# EAGLE design zSum_4_mainboard_rev_A (EAGLE 6.5.0)

## Sheet 1 of 2
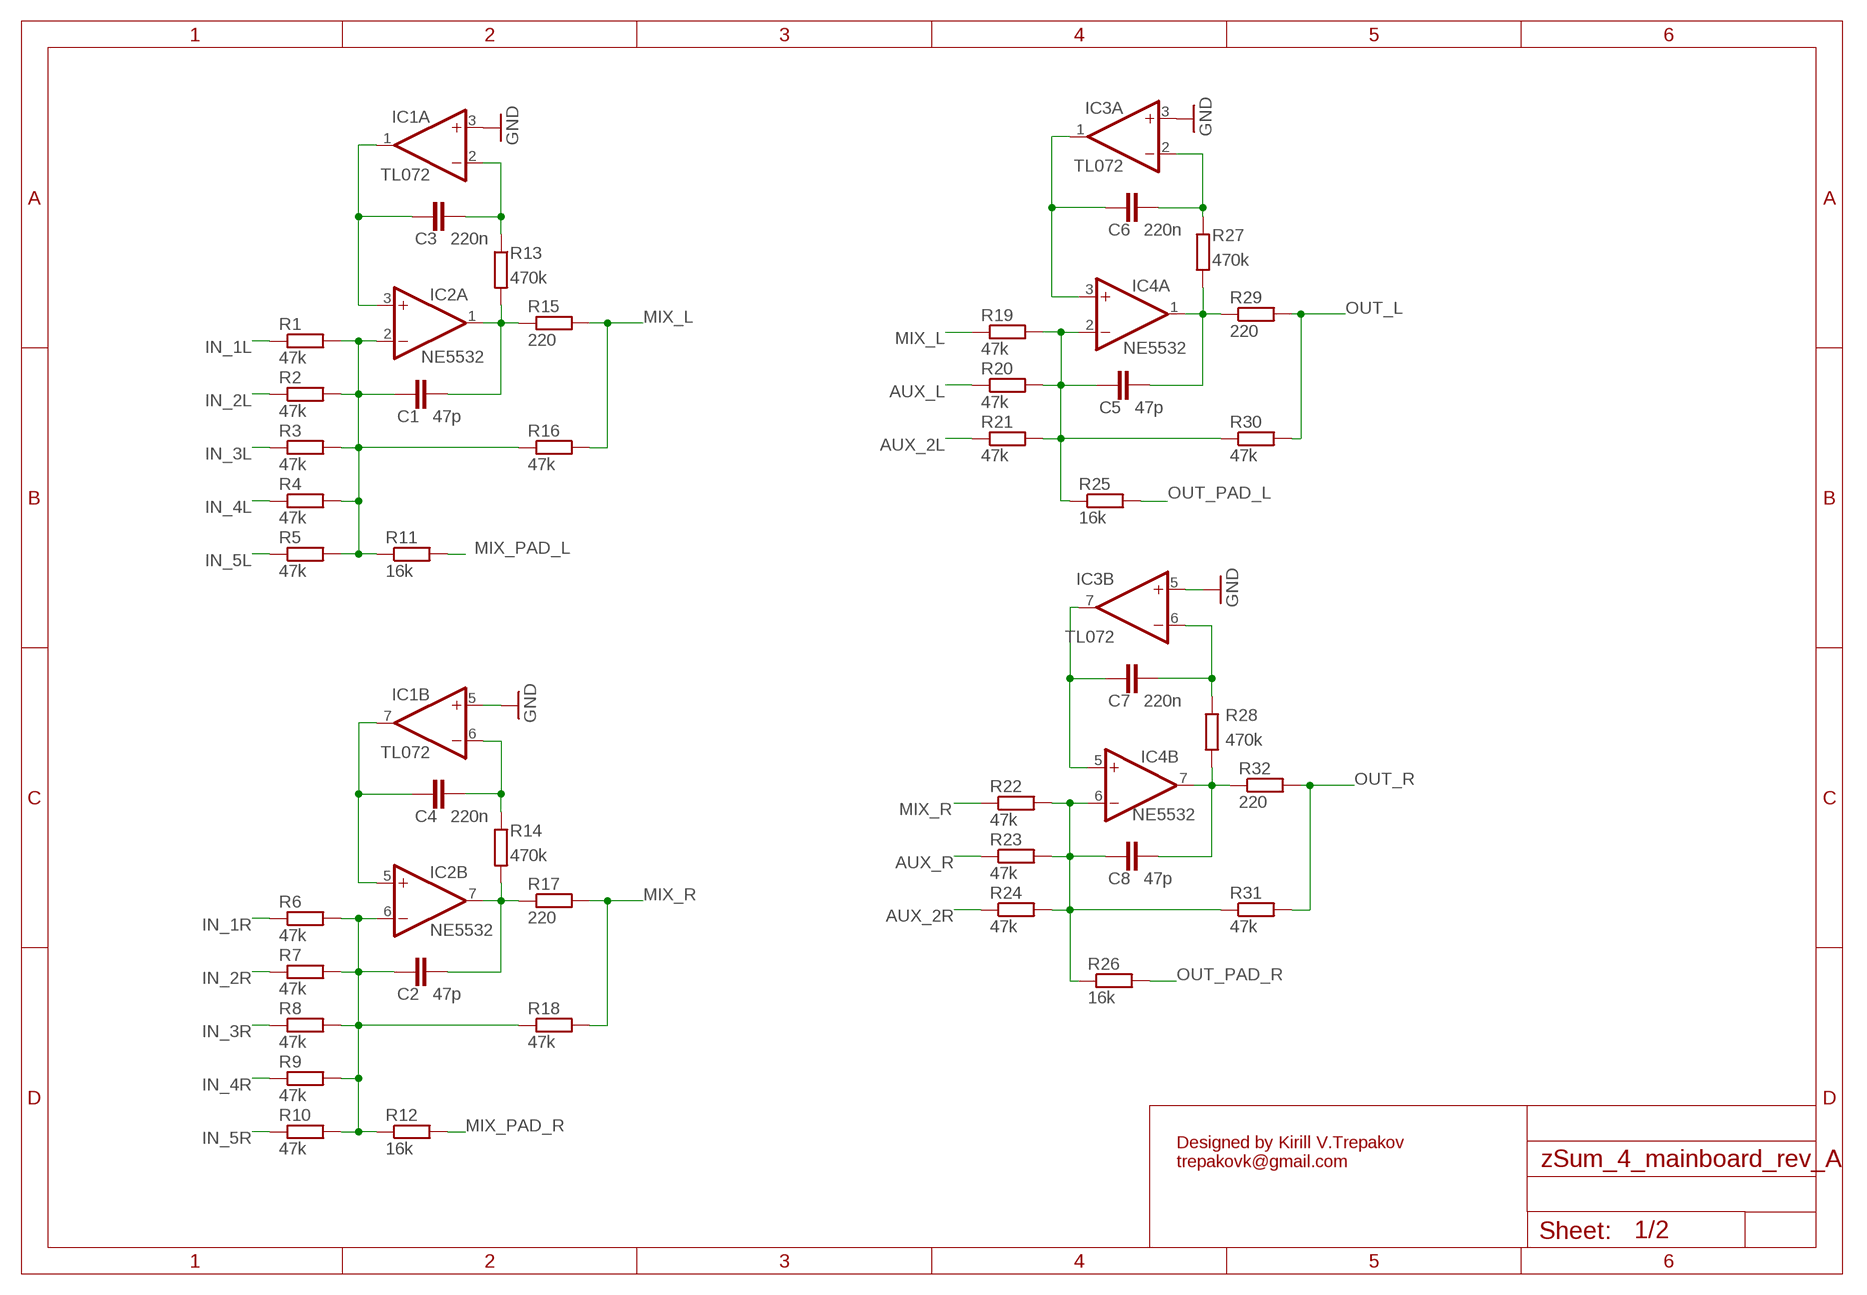
[diagram p0: schematic, sheet 1]

### Parts
C1  47p  C-EU025-025X050  [C025-025X050]
C2  47p  C-EU025-025X050  [C025-025X050]
C3  220n  C-EU050-025X075  [C050-025X075]
C4  220n  C-EU050-025X075  [C050-025X075]
C5  47p  C-EU025-025X050  [C025-025X050]
C6  220n  C-EU050-025X075  [C050-025X075]
C7  220n  C-EU050-025X075  [C050-025X075]
C8  47p  C-EU025-025X050  [C025-025X050]
IC1  TL072  TL072P  [DIL08]
IC2  NE5532  TL072P  [DIL08]
IC3  TL072  TL072P  [DIL08]
IC4  NE5532  TL072P  [DIL08]
R1  47k  R-EU_0207/7  [0207/7]
R2  47k  R-EU_0207/7  [0207/7]
R3  47k  R-EU_0207/7  [0207/7]
R4  47k  R-EU_0207/7  [0207/7]
R5  47k  R-EU_0207/7  [0207/7]
R6  47k  R-EU_0207/7  [0207/7]
R7  47k  R-EU_0207/7  [0207/7]
R8  47k  R-EU_0207/7  [0207/7]
R9  47k  R-EU_0207/7  [0207/7]
R10  47k  R-EU_0207/7  [0207/7]
R11  16k  R-EU_0207/7  [0207/7]
R12  16k  R-EU_0207/7  [0207/7]
R13  470k  R-EU_0207/7  [0207/7]
R14  470k  R-EU_0207/7  [0207/7]
R15  220  R-EU_0207/7  [0207/7]
R16  47k  R-EU_0207/7  [0207/7]
R17  220  R-EU_0207/7  [0207/7]
R18  47k  R-EU_0207/7  [0207/7]
R19  47k  R-EU_0207/7  [0207/7]
R20  47k  R-EU_0207/7  [0207/7]
R21  47k  R-EU_0207/7  [0207/7]
R22  47k  R-EU_0207/7  [0207/7]
R23  47k  R-EU_0207/7  [0207/7]
R24  47k  R-EU_0207/7  [0207/7]
R25  16k  R-EU_0207/7  [0207/7]
R26  16k  R-EU_0207/7  [0207/7]
R27  470k  R-EU_0207/7  [0207/7]
R28  470k  R-EU_0207/7  [0207/7]
R29  220  R-EU_0207/7  [0207/7]
R30  47k  R-EU_0207/7  [0207/7]
R31  47k  R-EU_0207/7  [0207/7]
R32  220  R-EU_0207/7  [0207/7]

### Nets
AUX_2L: R21.1 ; also sheet 2
AUX_2R: R24.1 ; also sheet 2
AUX_L: R20.1 ; also sheet 2
AUX_R: R23.1 ; also sheet 2
BIAS_L: C3.2 IC1.1(A:OUT) IC2.3(A:+IN)
BIAS_L1: C6.2 IC3.1(A:OUT) IC4.3(A:+IN)
BIAS_R: C4.2 IC1.7(B:OUT) IC2.5(B:+IN)
BIAS_R1: C7.2 IC3.7(B:OUT) IC4.5(B:+IN)
GND: IC1.3(A:+IN) IC1.5(B:+IN) IC3.3(A:+IN) IC3.5(B:+IN) ; also sheet 2
IN_1L: R1.1 ; also sheet 2
IN_1R: R6.1 ; also sheet 2
IN_2L: R2.1 ; also sheet 2
IN_2R: R7.1 ; also sheet 2
IN_3L: R3.1 ; also sheet 2
IN_3R: R8.1 ; also sheet 2
IN_4L: R4.1 ; also sheet 2
IN_4R: R9.1 ; also sheet 2
IN_5L: R5.1 ; also sheet 2
IN_5R: R10.1 ; also sheet 2
MIX_L: R15.2 R16.2 R19.1 ; also sheet 2
MIX_PAD_L: R11.2 ; also sheet 2
MIX_PAD_R: R12.2 ; also sheet 2
MIX_R: R17.2 R18.2 R22.1 ; also sheet 2
N$1: C6.1 IC3.2(A:-IN) R27.1
N$2: C7.1 IC3.6(B:-IN) R28.1
N$9: C3.1 IC1.2(A:-IN) R13.1
N$10: C1.1 IC2.1(A:OUT) R13.2 R15.1
N$11: C4.1 IC1.6(B:-IN) R14.1
N$12: C2.1 IC2.7(B:OUT) R14.2 R17.1
N$14: C5.1 IC4.1(A:OUT) R27.2 R29.1
N$20: C8.1 IC4.7(B:OUT) R28.2 R32.1
OUT_L: R29.2 R30.2 ; also sheet 2
OUT_PAD_L: R25.2 ; also sheet 2
OUT_PAD_R: R26.2 ; also sheet 2
OUT_R: R31.2 R32.2 ; also sheet 2
VGND_MIX_L: C1.2 IC2.2(A:-IN) R1.2 R2.2 R3.2 R4.2 R5.2 R11.1 R16.1
VGND_MIX_R: C2.2 IC2.6(B:-IN) R6.2 R7.2 R8.2 R9.2 R10.2 R12.1 R18.1
VGND_OUT_L: C5.2 IC4.2(A:-IN) R19.2 R20.2 R21.2 R25.1 R30.1
VGND_OUT_R: C8.2 IC4.6(B:-IN) R22.2 R23.2 R24.2 R26.1 R31.1

### Notes on the sheet
- Designed by Kirill V.Trepakov
  trepakovk@gmail.com

## Sheet 2 of 2
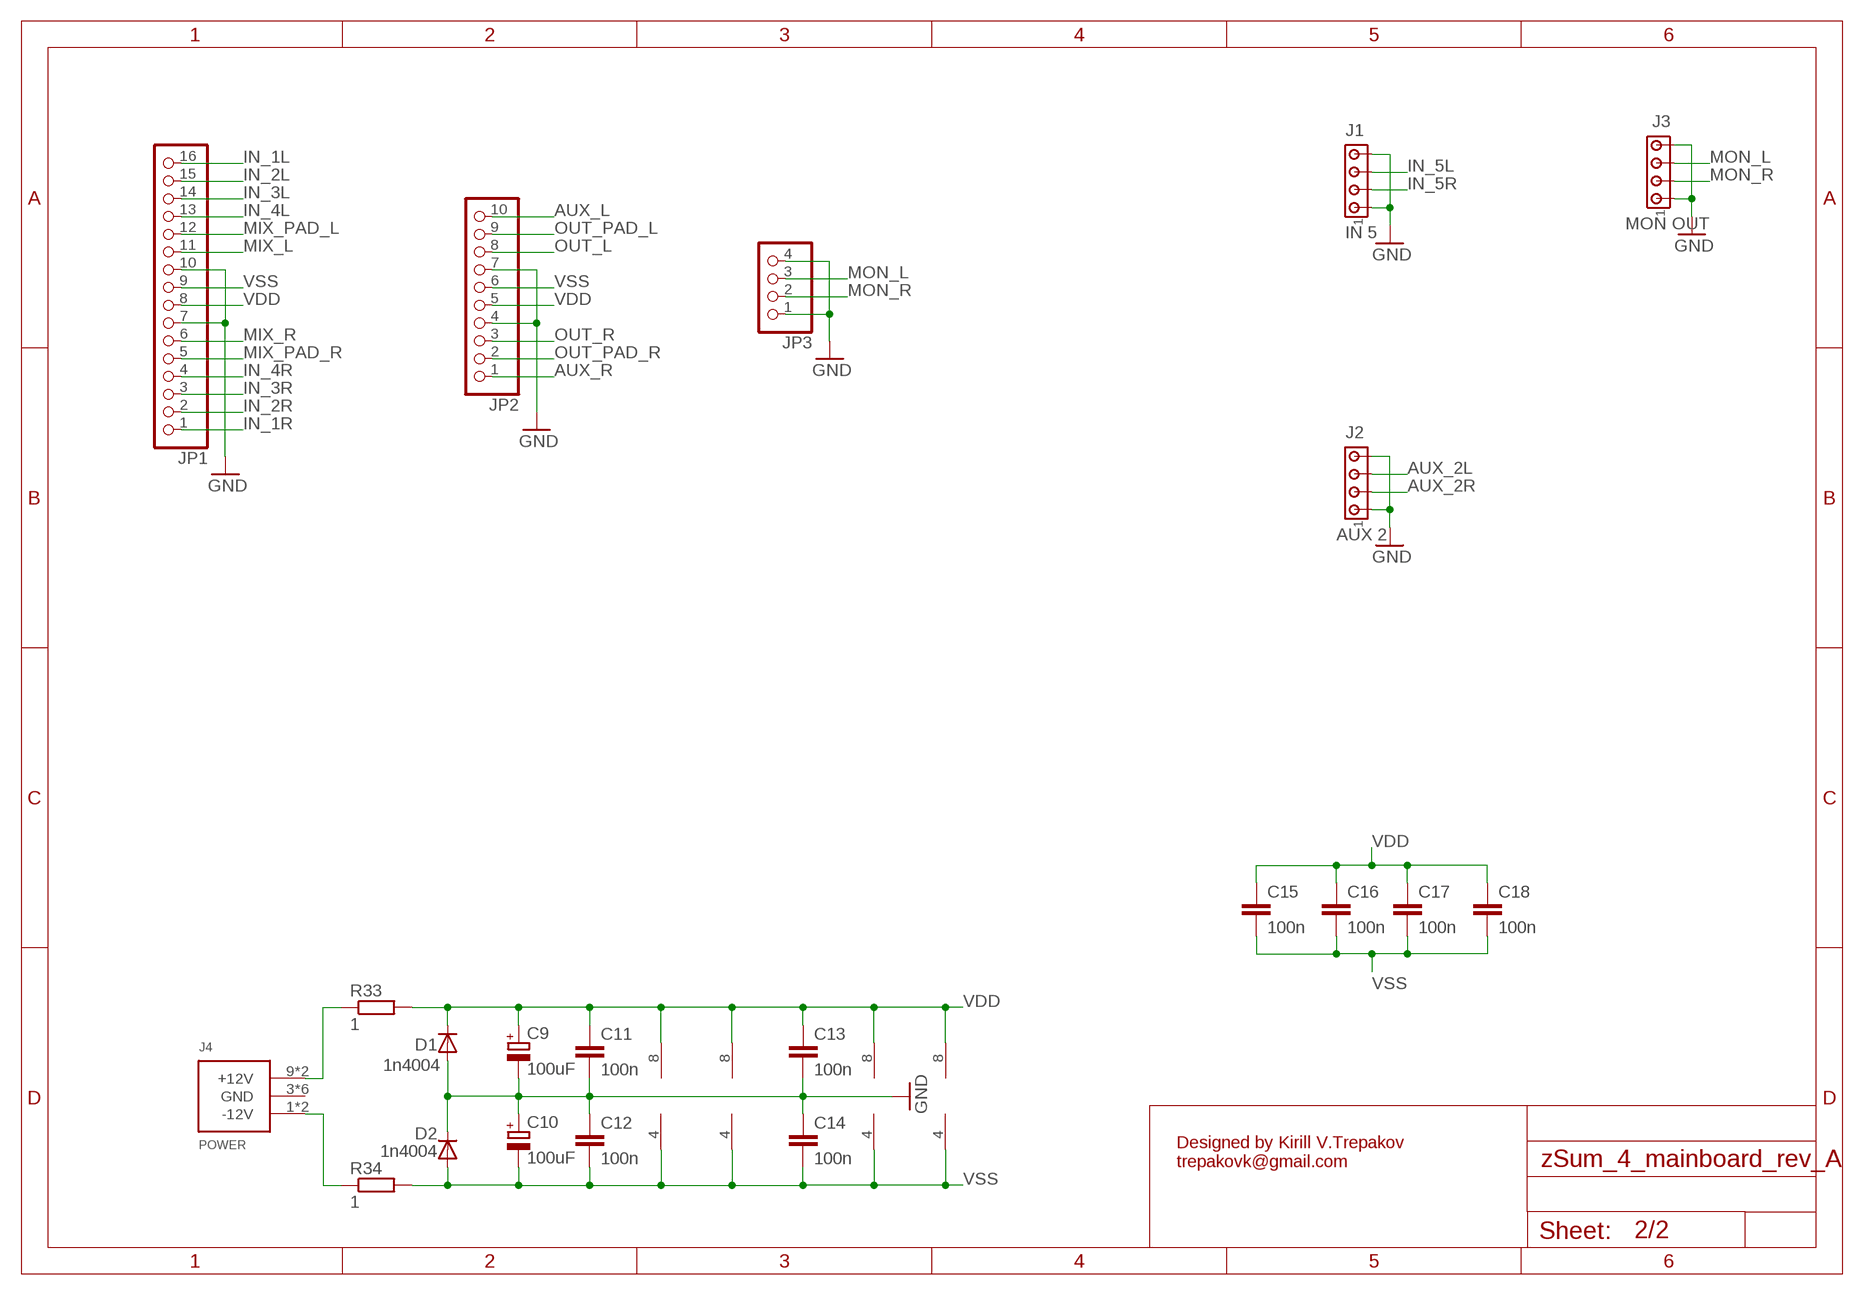
[diagram p1: schematic, sheet 2]

### Parts
C9  100uF  CPOL-EUE2.5-6  [E2,5-6]
C10  100uF  CPOL-EUE2.5-6  [E2,5-6]
C11  100n  C-EU050-025X075  [C050-025X075]
C12  100n  C-EU050-025X075  [C050-025X075]
C13  100n  C-EU050-025X075  [C050-025X075]
C14  100n  C-EU050-025X075  [C050-025X075]
C15  100n  C-EUC1206  [C1206]
C16  100n  C-EUC1206  [C1206]
C17  100n  C-EUC1206  [C1206]
C18  100n  C-EUC1206  [C1206]
D1  1n4004  1N4004"  [DO41-7.6]
D2  1n4004  1N4004"  [DO41-7.6]
J1  IN 5  MTA04-100  [10X04MTA]
J2  AUX 2  MTA04-100  [10X04MTA]
J3  MON OUT  MTA04-100  [10X04MTA]
J4  POWER  POWER_SIMPLEM  [POWER_10M]
JP1  PINHD-1X16  [1X16_]
JP2  PINHD-1X10  [1X10_]
JP3  PINHD-1X4  [1X04]
R33  1  R-EU_0207/7  [0207/7]
R34  1  R-EU_0207/7  [0207/7]

### Nets
AUX_2L: J2.3 ; also sheet 1
AUX_2R: J2.2 ; also sheet 1
AUX_L: JP2.10 ; also sheet 1
AUX_R: JP2.1 ; also sheet 1
GND: C9.- C10.+ C11.2 C12.1 C13.2 C14.1 D1.A D2.C J1.1 J1.4 J2.1 J2.4 J3.1 J3.4 JP1.7 JP1.10 JP2.4 JP2.7 JP3.1 JP3.4 ; also sheet 1
IN_1L: JP1.16 ; also sheet 1
IN_1R: JP1.1 ; also sheet 1
IN_2L: JP1.15 ; also sheet 1
IN_2R: JP1.2 ; also sheet 1
IN_3L: JP1.14 ; also sheet 1
IN_3R: JP1.3 ; also sheet 1
IN_4L: JP1.13 ; also sheet 1
IN_4R: JP1.4 ; also sheet 1
IN_5L: J1.3 ; also sheet 1
IN_5R: J1.2 ; also sheet 1
MIX_L: JP1.11 ; also sheet 1
MIX_PAD_L: JP1.12 ; also sheet 1
MIX_PAD_R: JP1.5 ; also sheet 1
MIX_R: JP1.6 ; also sheet 1
MON_L: J3.3 JP3.3
MON_R: J3.2 JP3.2
N$3: J4.1(-12V) J4.2(-12V) R34.1
N$4: J4.9(+12V) J4.10(+12V) R33.1
OUT_L: JP2.8 ; also sheet 1
OUT_PAD_L: JP2.9 ; also sheet 1
OUT_PAD_R: JP2.2 ; also sheet 1
OUT_R: JP2.3 ; also sheet 1
VDD: C9.+ C11.1 C13.1 C15.1 C16.1 C17.1 C18.1 D1.C IC1.8(P:V+) IC2.8(P:V+) IC3.8(P:V+) IC4.8(P:V+) JP1.8 JP2.5 R33.2
VSS: C10.- C12.2 C14.2 C15.2 C16.2 C17.2 C18.2 D2.A IC1.4(P:V-) IC2.4(P:V-) IC3.4(P:V-) IC4.4(P:V-) JP1.9 JP2.6 R34.2
Unconnected: J4.3(GND) J4.4(GND) J4.5(GND) J4.6(GND) J4.7(GND) J4.8(GND)

### Notes on the sheet
- Designed by Kirill V.Trepakov
  trepakovk@gmail.com

## Library data of the parts
C1-C8 C11-C18 = rcl:C-EU: CAPACITOR, European symbol
C9 C10 = rcl:CPOL-EU: POLARIZED CAPACITOR, European symbol
D1 D2 = _motovilo:1N4004: DIODE general purpose rectifier, 1 A
IC1-IC4 = kvitekp:TL072: OP AMP
J1-J3 = con-amp:MTA04-100: AMP connector
J4 = _motovilo:POWER_SIMPLE
JP1 = _mtvl.connectors:PINHD-1X16: PIN HEADER
JP2 = _mtvl.connectors:PINHD-1X10: PIN HEADER
JP3 = _mtvl.connectors:PINHD-1X4: PIN HEADER
R1-R34 = rcl:R-EU_: RESISTOR, European symbol

## Board
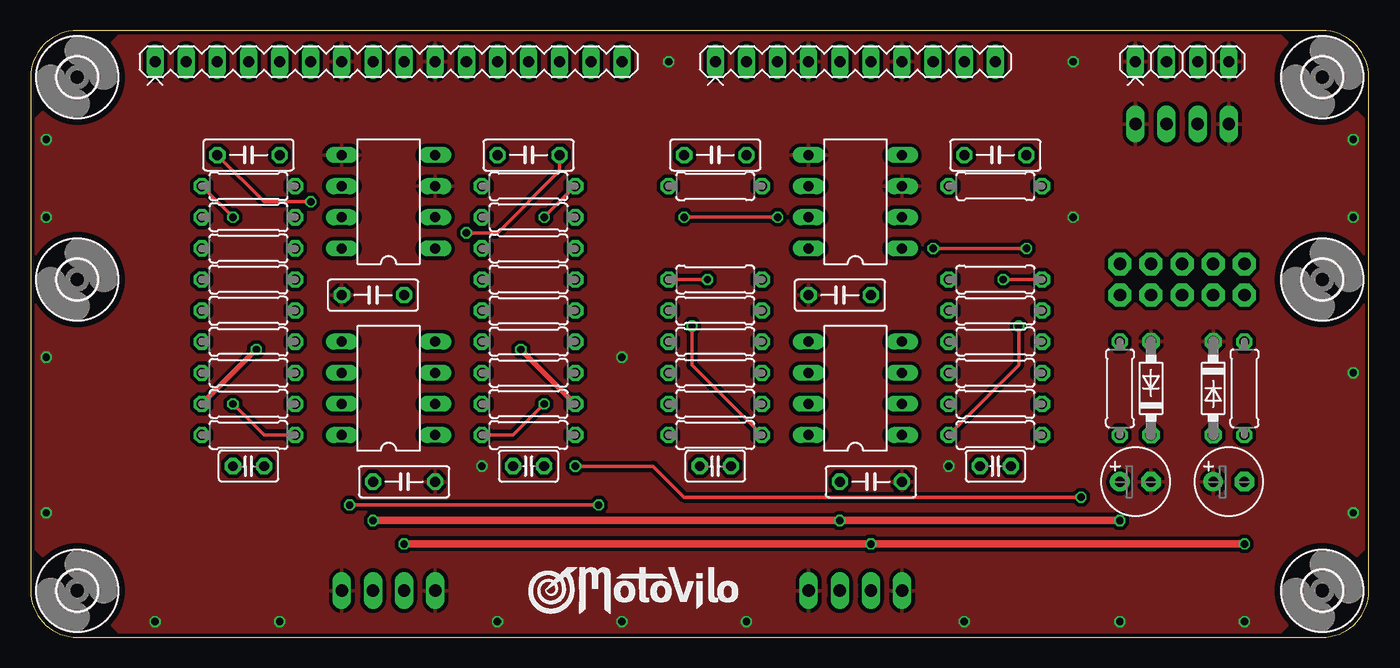
[diagram p2: board, top side]
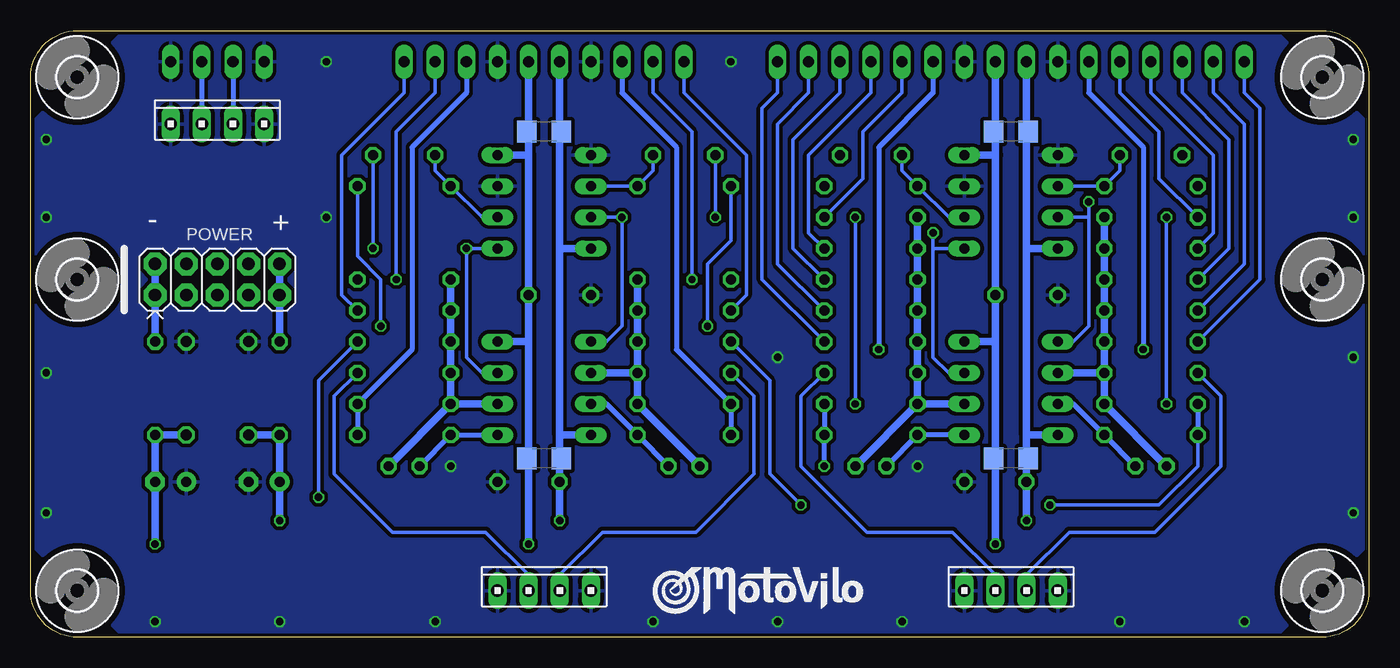
[diagram p3: board, bottom side, seen from below]

Size 109.22 x 49.53 mm. Coordinates in mm from the lower left corner, seen from the top.
Outline: 3.81,0 105.41,0 arc90 109.22,3.81 109.22,45.72 arc90 105.41,49.53 3.81,49.53 arc90 0,45.72 0,3.81 arc90 3.81,0
Copper layers (1*16): Top 0.035mm / dielectric 1.5mm / Bottom 0.035mm
Design rules "ITEADstudio_DRC_z *": minimum track width 6mil, minimum drill 12mil, track to track 10mil, track to pad 10mil, pad to pad 10mil, via to via 10mil, smd to smd 0mil, copper to edge 10mil, drill to drill 10mil, minimum pad ring 10mil, minimum via ring 6mil, stop-mask expansion 2mil, vias tented up to drill 100mil, thermal gap 12mil

### Footprints (pad centres in the part's own frame; a part is rotated, then mirrored left to right if it is on the bottom)
C025-025X050 = drill 0.813 octagon: 1 -1.27,0; 2 1.27,0
C050-025X075 = drill 0.813 octagon: 1 -2.54,0; 2 2.54,0
E2,5-6 = drill 0.813 pad 1.6: + -1.27,0 | drill 0.813 pad 1.6 octagon: - 1.27,0
C1206 = smd 1.6 x 1.8: 1 -1.4,0; 2 1.4,0
DO41-7.6 = drill 0.9 octagon: A 3.81,0; C -3.81,0
DIL08 = drill 0.813 long: 1 -3.81,-3.81; 2 -1.27,-3.81; 3 1.27,-3.81; 4 3.81,-3.81; 5 3.81,3.81; 6 1.27,3.81; 7 -1.27,3.81; 8 -3.81,3.81
10X04MTA = drill 1.016 long: 1 3.81,0; 2 1.27,0; 3 -1.27,0; 4 -3.81,0
POWER_10M = drill 1.016 pad 1.88 octagon: 1 1.27,-5.08; 2 -1.27,-5.08; 3 1.27,-2.54; 4 -1.27,-2.54; 5 1.27,0; 6 -1.27,0; 7 1.27,2.54; 8 -1.27,2.54; 9 1.27,5.08; 10 -1.27,5.08
1X16_ = drill 0.9 long: 1 -19.05,0; 2 -16.51,0; 3 -13.97,0; 4 -11.43,0; 5 -8.89,0; 6 -6.35,0; 7 -3.81,0; 8 -1.27,0; 9 1.27,0; 10 3.81,0; 11 6.35,0; 12 8.89,0; 13 11.43,0; 14 13.97,0; 15 16.51,0; 16 19.05,0
1X10_ = drill 0.9 long: 1 -11.43,0; 2 -8.89,0; 3 -6.35,0; 4 -3.81,0; 5 -1.27,0; 6 1.27,0; 7 3.81,0; 8 6.35,0; 9 8.89,0; 10 11.43,0
1X04 = drill 0.9 long: 1 -3.81,0; 2 -1.27,0; 3 1.27,0; 4 3.81,0
0207/7 = drill 0.813 octagon: 1 -3.81,0; 2 3.81,0
3,2_NEW = hole 3.2: 0,0

### Placement (x,y rotation side)
C1  40.64,13.97 0 top
C2  17.78,13.97 180 top
C3  40.64,39.37 0 top
C4  17.78,39.37 180 top
C5  78.74,13.97 0 top
C6  78.74,39.37 0 top
C7  55.88,39.37 180 top
C8  55.88,13.97 180 top
C9  90.17,12.7 0 top
C10  97.79,12.7 0 top
C11  30.48,12.7 0 top
C12  27.94,27.94 0 top
C13  68.58,12.7 0 top
C14  66.04,27.94 0 top
C15  29.21,41.27 180 bottom
C16  67.31,41.27 180 bottom
C17  29.21,14.61 180 bottom
C18  67.31,14.61 180 bottom
D1  91.44,20.32 90 top
D2  96.52,20.32 270 top
IC1  29.21,35.56 90 top
IC2  29.21,20.32 90 top
IC3  67.31,35.56 90 top
IC4  67.31,20.32 90 top
J1  29.21,3.81 0 bottom
J2  67.31,3.81 0 bottom
J3  93.98,41.91 0 bottom
J4  93.98,29.21 270 bottom
JP1  29.21,46.99 0 top
JP2  67.31,46.99 0 top
JP3  93.98,46.99 0 top
R1  40.64,24.13 180 top
R2  40.64,26.67 180 top
R3  40.64,29.21 180 top
R4  40.64,31.75 180 top
R5  40.64,21.59 180 top
R6  17.78,24.13 0 top
R7  17.78,26.67 0 top
R8  17.78,29.21 0 top
R9  17.78,31.75 0 top
R10  17.78,21.59 0 top
R11  40.64,34.29 0 top
R12  17.78,34.29 180 top
R13  40.64,36.83 0 top
R14  17.78,36.83 180 top
R15  40.64,16.51 0 top
R16  40.64,19.05 0 top
R17  17.78,16.51 180 top
R18  17.78,19.05 180 top
R19  78.74,24.13 180 top
R20  78.74,26.67 180 top
R21  78.74,21.59 180 top
R22  55.88,24.13 0 top
R23  55.88,26.67 0 top
R24  55.88,21.59 0 top
R25  78.74,29.21 0 top
R26  55.88,29.21 180 top
R27  78.74,36.83 0 top
R28  55.88,36.83 180 top
R29  78.74,16.51 0 top
R30  78.74,19.05 0 top
R31  55.88,19.05 180 top
R32  55.88,16.51 180 top
R33  88.9,20.32 270 top
R34  99.06,20.32 270 top
U$1  [3,2_NEW]  3.81,45.72 0 top
U$2  [3,2_NEW]  105.41,45.72 0 top
U$3  [3,2_NEW]  3.81,29.21 0 top
U$4  [3,2_NEW]  105.41,29.21 0 top
U$5  [3,2_NEW]  3.81,3.81 0 top
U$6  [3,2_NEW]  105.41,3.81 0 top
U$7  [LOGO_SPACE_002]  58.42,1.91 0 bottom
U$8  [LOGO_SPACE_002]  40.64,1.91 0 top

### Tracks (layer width: path | path; a pad name or v marks a point on that pad's centre or on a via)
AUX_2L
  Bottom 0.305: R21.1 84.45,19.68 84.45,13.34 79.69,8.57 72.07,8.57 68.58,5.08 J2.3
AUX_2R
  Bottom 0.305: R24.1 50.16,19.68 50.16,13.34 54.93,8.57 62.55,8.57 66.04,5.08 J2.2
AUX_L
  Bottom 0.305: R20.1 83.82,27.94 83.82,39.37 78.74,44.45 JP2.10
AUX_R
  Bottom 0.305: R23.1 50.8,27.94 50.8,39.37 55.88,44.45 JP2.1
BIAS_L  (via drill 0.6)
  Top 0.305: v35.56,33.02 38.1,33.02 43.18,38.1 C3.2
  Bottom 0.305: IC2.3 34.29,21.59 35.56,22.86 35.56,31.75 | 35.56,31.75 v35.56,33.02 | IC1.1 35.56,31.75
BIAS_L1  (via drill 0.6)
  Top 0.305: v81.28,31.75 v73.66,31.75
  Bottom 0.305: C6.2 v81.28,31.75 | IC3.1 v73.66,31.75 73.66,22.86 72.39,21.59 IC4.3
BIAS_R  (via drill 0.6)
  Top 0.305: C4.2 19.05,35.56 v22.86,35.56
  Bottom 0.305: IC2.5 24.13,24.13 22.86,25.4 22.86,34.29 | 22.86,34.29 IC1.7 | 22.86,34.29 v22.86,35.56
BIAS_R1  (via drill 0.6)
  Top 0.305: v53.34,34.29 v60.96,34.29
  Bottom 0.305: IC3.7 v60.96,34.29 60.96,25.4 62.23,24.13 IC4.5 | C7.2 v53.34,34.29
GND  (via drill 0.6)
  other vias: 85.09,46.99 107.95,34.29 85.09,34.29 107.95,21.59 107.95,10.16 99.06,1.27 88.9,1.27 76.2,1.27 58.42,1.27 48.26,22.86 38.1,1.27 20.32,1.27 10.16,1.27 1.27,10.16 1.27,22.86 1.27,34.29 1.27,40.64 36.83,13.97 107.95,40.64 52.07,46.99 48.26,1.27 74.93,13.97
  pour Top (isolate 0.305): 7.62,0 0,7.62 0,41.91 7.62,49.53 101.6,49.53 109.22,41.91 109.22,7.62 101.6,0
  pour Bottom (isolate 0.305): 7.62,0 0,7.62 0,41.91 7.62,49.53 101.6,49.53 109.22,41.91 109.22,7.62 101.6,0
IN_1L
  Bottom 0.305: R1.1 49.53,29.21 49.53,43.18 48.26,44.45 JP1.16
IN_1R
  Bottom 0.305: R6.1 8.89,29.21 8.89,43.18 10.16,44.45 JP1.1
IN_2L
  Bottom 0.305: R2.1 48.26,30.48 48.26,41.91 45.72,44.45 JP1.15
IN_2R
  Bottom 0.305: R7.1 10.16,30.48 10.16,41.91 12.7,44.45 JP1.2
IN_3L
  Bottom 0.305: JP1.14 43.18,44.45 46.99,40.64 46.99,31.75 R3.1
IN_3R
  Bottom 0.305: R8.1 11.43,31.75 11.43,40.64 15.24,44.45 JP1.3
IN_4L
  Bottom 0.305: R4.1 45.72,33.02 45.72,39.37 40.64,44.45 JP1.13
IN_4R
  Bottom 0.305: R9.1 12.7,33.02 12.7,39.37 17.78,44.45 JP1.4 17.78,45.72
IN_5L
  Bottom 0.305: J1.3 30.48,5.08 33.97,8.57 40.96,8.57 46.35,13.97 46.35,19.68 R5.1
IN_5R
  Bottom 0.305: R10.1 12.06,19.68 12.06,13.97 17.46,8.57 24.45,8.57 27.94,5.08 J1.2
MIX_L  (via drill 0.6)
  Top 0.305: v44.45,13.97 50.8,13.97 53.34,11.43 v85.72,11.43
  Top 0.406: v40.01,23.5 R16.2
  Bottom 0.305: R19.1 85.72,20.95 v85.72,11.43
  Bottom 0.406: R16.2 R15.2 v44.45,13.97 | JP1.11 35.56,44.45 40.01,40.01 v40.01,23.5
MIX_PAD_L
  Bottom 0.305: JP1.12 38.1,44.45 41.27,41.27 41.27,37.47 R11.2
MIX_PAD_R
  Bottom 0.305: JP1.5 20.32,44.45 17.14,41.27 17.14,37.47 R12.2
MIX_R  (via drill 0.6)
  Top 0.305: v26.04,10.79 v46.35,10.79
  Top 0.406: v18.41,23.5 R18.2
  Bottom 0.305: R22.1 48.9,20.95 48.9,13.34 v46.35,10.79 | R17.2 13.97,13.97 17.14,10.79 v26.04,10.79
  Bottom 0.406: R18.2 R17.2 | JP1.6 22.86,44.45 18.41,40.01 v18.41,23.5
MON_L
  Bottom 0.406: JP3.3 J3.3
MON_R
  Bottom 0.406: JP3.2 J3.2
N$1
  Bottom 0.305: IC3.2 72.39,34.29 R27.1 76.2,38.1 C6.1
N$2
  Bottom 0.305: IC3.6 R28.1 58.42,38.1 C7.1
N$3
  Bottom 0.61: J4.2 J4.1 R34.1
N$4
  Bottom 0.61: J4.10 J4.9 R33.1
N$9
  Bottom 0.305: IC1.2 34.29,34.29 R13.1 38.1,38.1 C3.1
N$10  (via drill 0.6)
  Top 0.305: R13.2 v41.91,34.29 | R15.1 39.37,16.51 v41.91,19.05
  Bottom 0.305: v41.91,19.05 v41.91,34.29
  Bottom 0.406: IC2.1 R15.1 C1.1
N$11
  Bottom 0.305: IC1.6 R14.1 20.32,38.1 C4.1
N$12  (via drill 0.6)
  Top 0.305: R17.1 19.05,16.51 v16.51,19.05 | R14.2 v16.51,34.29
  Bottom 0.305: v16.51,19.05 v16.51,34.29
  Bottom 0.406: C2.1 R17.1 24.13,19.05 IC2.7
N$14  (via drill 0.6)
  Top 0.305: R29.1 80.64,22.23 v80.64,25.4
  Bottom 0.305: R27.2 82.55,31.11 80.64,29.21 v80.64,25.4
  Bottom 0.406: C5.1 R29.1 IC4.1
N$20  (via drill 0.6)
  Top 0.305: R32.1 53.98,22.23 v53.98,25.4
  Bottom 0.305: R28.2 52.07,32.38 53.98,30.48 v53.98,25.4
  Bottom 0.406: C8.1 R32.1 62.23,19.05 IC4.7
OUT_L
  Bottom 0.406: R29.2 R30.2 78.11,23.5 78.11,40.01 73.66,44.45 JP2.8
OUT_PAD_L  (via drill 0.6)
  Top 0.305: v79.38,29.21 R25.2
  Bottom 0.305: JP2.9 76.2,44.45 79.38,41.27 v79.38,29.21
OUT_PAD_R  (via drill 0.6)
  Top 0.305: v55.24,29.21 R26.2
  Bottom 0.305: JP2.2 58.42,44.45 55.24,41.27 v55.24,29.21
OUT_R
  Bottom 0.406: R32.2 R31.2 56.52,23.5 56.52,40.01 60.96,44.45 JP2.3
VDD  (via drill 0.6)
  Top 0.61: v27.94,9.53 v66.04,9.53 v88.9,9.53
  Bottom 0.61: IC1.8 27.94,31.75 | IC2.8 27.94,16.51 | IC3.8 66.04,31.75 | v66.04,9.53 C13.1 66.04,14.47 C18.1 66.04,14.73 66.04,16.51 | D1.C R33.2 C9.+ v88.9,9.53 | v27.94,9.53 C11.1 27.94,14.47 C17.1 27.94,14.73 27.94,16.51 | 27.94,16.51 27.94,31.75 | 66.04,16.51 66.04,31.75 | IC4.8 66.04,16.51 | JP1.8 27.94,41.41 C15.1 27.94,41.15 27.94,31.75 | 66.04,31.75 66.04,41.15 C16.1 66.04,41.41 JP2.5
VGND_MIX_L
  Bottom 0.61: IC2.2 R16.1 | R16.1 R5.2 R1.2 R2.2 R3.2 R4.2 R11.1 | R16.1 C1.2
VGND_MIX_R
  Bottom 0.61: IC2.6 R10.2 | R10.2 R18.1 C2.2 | R10.2 R6.2 R7.2 R8.2 R9.2 R12.1
VGND_OUT_L
  Bottom 0.61: R25.1 R20.2 R19.2 R21.2 R30.1 | IC4.2 R30.1 | R30.1 C5.2
VGND_OUT_R
  Bottom 0.61: IC4.6 R24.2 | R24.2 R31.1 C8.2 | R24.2 R22.2 R23.2 R26.1
VSS  (via drill 0.6)
  Top 0.61: v30.48,7.62 v68.58,7.62 v99.06,7.62
  Bottom 0.61: IC1.4 30.48,39.37 | 30.48,24.13 IC2.4 | 68.58,39.37 C14.2 68.58,24.13 | IC3.4 68.58,39.37 | IC4.4 68.58,24.13 | D2.A R34.2 C10.- v99.06,7.62 | 30.48,24.13 C12.2 30.48,39.37 | v30.48,7.62 30.48,14.47 C17.2 30.48,14.73 30.48,24.13 | JP1.9 30.48,41.41 C15.2 30.48,41.15 30.48,39.37 | JP2.6 68.58,41.41 C16.2 68.58,41.15 68.58,39.37 | v68.58,7.62 68.58,14.47 C18.2 68.58,14.73 68.58,24.13

### Text on the board
bPlace: + | -
tValues: zSum-4 mainboard Rev. A
bValues: zSum-4 mainboard Rev. A